# EAGLE design deneme (EAGLE 9.3.2)
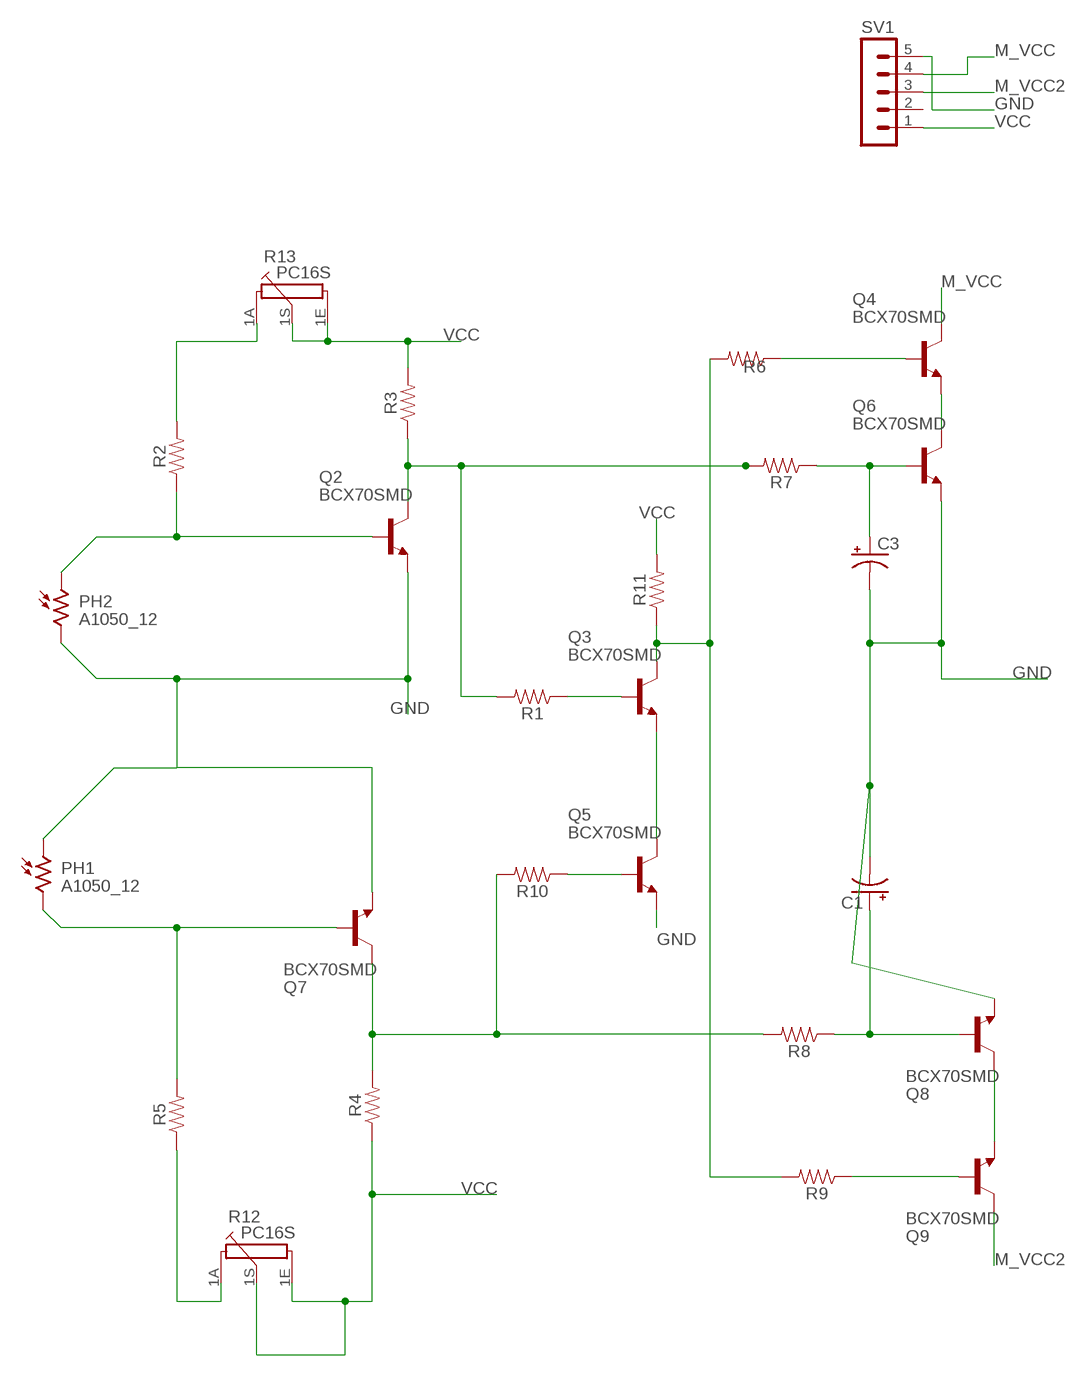
[diagram p0: schematic, sheet 1]

## Parts
C1  CPOL-USUD-6,3X7,7  [UD-6,3X7,7_NICHICON]
C3  CPOL-USUD-6,3X7,7  [UD-6,3X7,7_NICHICON]
PH1  A1050_12  [T0-46-A10XX]
PH2  A1050_12  [T0-46-A10XX]
Q2  BCX70SMD  [SOT23]
Q3  BCX70SMD  [SOT23]
Q4  BCX70SMD  [SOT23]
Q5  BCX70SMD  [SOT23]
Q6  BCX70SMD  [SOT23]
Q7  BCX70SMD  [SOT23]
Q8  BCX70SMD  [SOT23]
Q9  BCX70SMD  [SOT23]
R1  RESISTOR0805  [0805]
R2  RESISTOR0805  [0805]
R3  RESISTOR0805  [0805]
R4  RESISTOR0805  [0805]
R5  RESISTOR0805  [0805]
R6  RESISTOR0805  [0805]
R7  RESISTOR0805  [0805]
R8  RESISTOR0805  [0805]
R9  RESISTOR0805  [0805]
R10  RESISTOR0805  [0805]
R11  RESISTOR0805  [0805]
R12  PC16S  [PC16S]
R13  PC16S  [PC16S]
SV1  MA05-1  [MA05-1]

## Nets
GND: C1.- C3.- PH1.1 PH2.2 Q2.2(E) Q5.2(E) Q6.2(E) Q7.2(E) Q8.2(E) SV1.5
M_VCC: Q4.3(C) SV1.4
M_VCC2: Q9.3(C) SV1.3
N$1: R2.2 R13.1A
N$3: C3.+ Q6.1(B) R7.1
N$4: PH2.1 Q2.1(B) R2.1
N$5: Q4.1(B) R6.1
N$6: PH1.2 Q7.1(B) R5.2
N$7: R5.1 R12.1A
N$9: Q7.3(C) R4.2 R8.2 R10.2
N$10: Q5.1(B) R10.1
N$11: Q3.2(E) Q5.3(C)
N$12: Q3.1(B) R1.1
N$13: Q3.3(C) R6.2 R9.2 R11.1
N$14: Q2.3(C) R1.2 R3.1 R7.2
N$15: Q4.2(E) Q6.3(C)
N$19: C1.+ Q8.1(B) R8.1
N$20: Q8.3(C) Q9.2(E)
N$21: Q9.1(B) R9.1
VCC: R3.2 R4.1 R11.2 R12.1E R12.1S R13.1E R13.1S SV1.1
Unconnected: SV1.2

## Library data of the parts
C1 C3 = rcl:CPOL-US: POLARIZED CAPACITOR, American symbol; SPICEPREFIX: C
PH1 PH2 = photo-elements:A10: Sensor Robust Light Sensing Applications Outdoor Light Sensing Application Source: http://optoelectronics.perkinelmer.com/content/Datasheets/DTS_PhotocellsA1050.pdf
Q2-Q9 = transistor-npn:BCX70*: NPN Transistor
R1-R11 = SparkFun-Resistors:RESISTOR: Generic Resistor Package
R12 R13 = piher:PC16S: POTENTIOMETER single carbon potentiometer, 16 mm, S3ROH; OC_FARNELL: 4452940; OC_NEWARK: unknown
SV1 = con-lstb:MA05-1: PIN HEADER; OC_FARNELL: unknown; OC_NEWARK: unknown

## Board
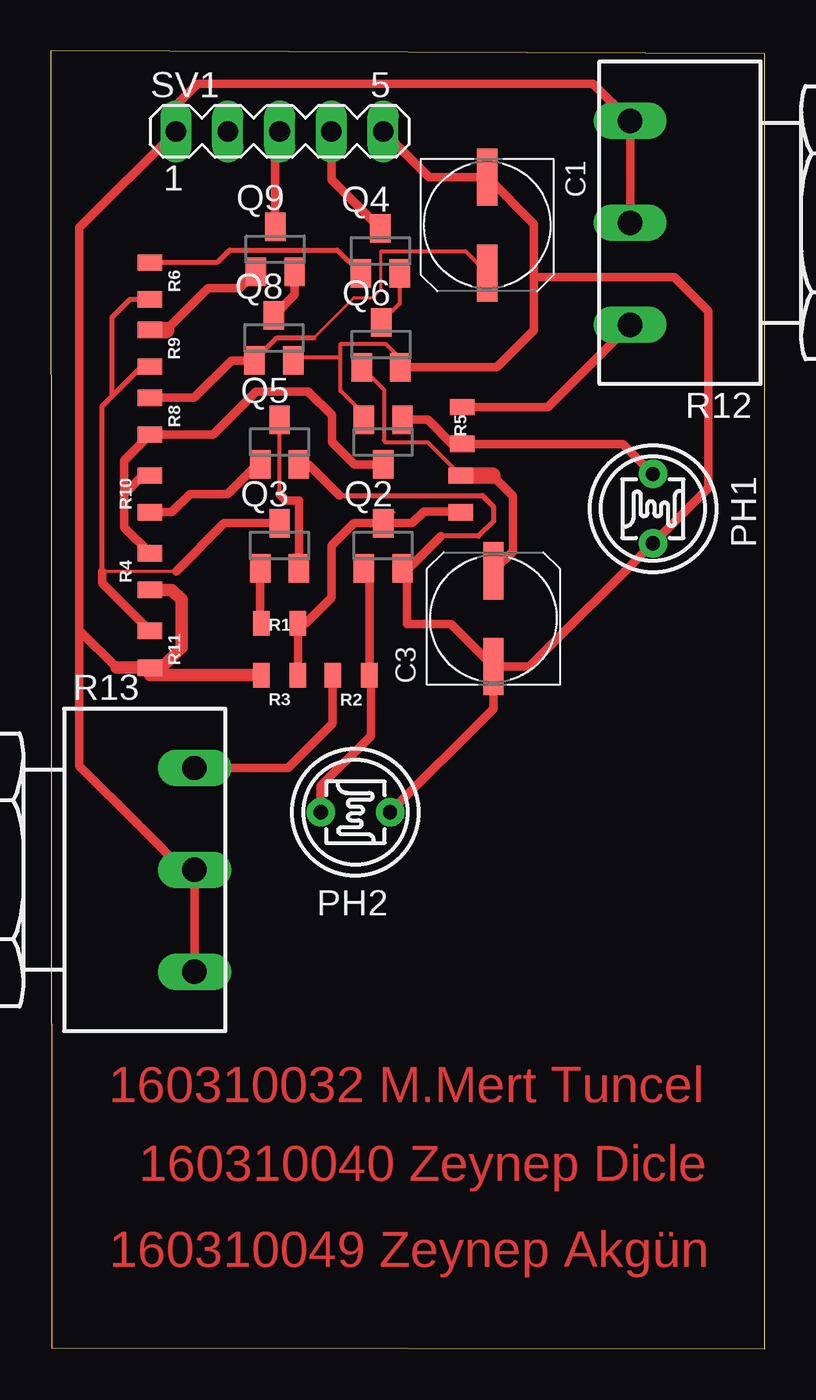
[diagram p1: board, top side]

Size 35.01 x 63.63 mm. Coordinates in mm from the lower left corner, seen from the top.
Outline: 0.03,0.02 35.01,0 35.01,63.49 0,63.63 0.03,0.02
Copper layers (1*16): Top 0.035mm / dielectric 1.5mm / Bottom 0.035mm
Design rules "default": minimum track width 6mil, minimum drill 0.35mm, track to track 6mil, track to pad 6mil, pad to pad 6mil, via to via 6mil, smd to smd 6mil, copper to edge 40mil, drill to drill 6mil, minimum pad ring 10mil, minimum via ring 8mil, stop-mask expansion 4mil, vias tented up to drill 0mil, thermal gap 10mil

### Footprints (pad centres in the part's own frame; a part is rotated, then mirrored left to right if it is on the bottom)
UD-6,3X7,7_NICHICON = smd 2.8 x 1: + 2.35,0; - -2.35,0
T0-46-A10XX = drill 0.7 pad 1.4: 1 -1.7,0; 2 1.7,0
SOT23 = smd 1 x 1.4: 1 -0.95,-1.1; 2 0.95,-1.1; 3 0,1.1
0805 = smd 0.8 x 1.2: 1 -0.9,0; 2 0.9,0
PC16S = drill 1.2 long: 1A -5,6.5; 1E 5,6.5; 1S 0,6.5
MA05-1 = drill 1.016 long: 1 -5.08,0; 2 -2.54,0; 3 0,0; 4 2.54,0; 5 5.08,0

### Placement (x,y rotation side)
C1  21.4,55.09 270 top
C3  21.7,35.79 90 top
PH1  29.53,41.19 90 top
PH2  14.94,26.3 0 top
Q2  16.29,39.37 0 top
Q3  11.21,39.37 0 top
Q4  16.15,53.82 0 top
Q5  11.21,44.45 0 top
Q6  16.19,49.23 0 top
Q7  16.29,44.45 180 top
Q8  10.93,49.56 0 top
Q9  11,53.9 0 top
R1  11.21,35.56 0 top
R2  14.72,33.01 180 top
R3  11.21,33.02 180 top
R4  4.86,38.1 90 top
R5  20.17,45.26 270 top
R6  4.86,52.35 270 top
R7  20.1,41.91 270 top
R8  4.86,45.72 270 top
R9  4.85,49.05 270 top
R10  4.86,41.91 90 top
R11  4.86,34.29 270 top
R12  34.91,55.21 90 top
R13  0.55,23.47 270 top
SV1  11.21,59.69 0 top

### Tracks (layer width: path | path; a pad name or v marks a point on that pad's centre or on a via)
GND
  Top 0.203: Q7.2 15.34,45.82 14.2,46.97 14.2,48.6 | 14.2,48.6 14.2,49.24 16.44,49.24 17.14,48.54 Q6.2 | 14.2,48.6 12.03,48.6
  Top 0.254: 14.15,41.83 21.16,41.83 21.7,41.29 21.7,40.56 20.98,39.84 19.13,39.84
  Top 0.406: 12.03,48.6 Q8.2 | Q5.2 12.63,43.35 14.15,41.83 | 19.13,39.84 17.56,38.27 Q2.2 17.46,38.05 17.46,35.52 19.62,35.52 C3.- | SV1.5 18.54,57.44 C1.- 23.7,55.14 23.7,52.54 | 23.7,52.54 23.7,49.95 21.87,48.12 Q6.2 | 23.7,52.54 30.57,52.54 32.25,50.86 32.25,42.2 PH1.1 23.48,33.44 C3.- | PH2.2 21.7,31.37 C3.-
M_VCC
  Top 0.406: Q4.3 13.75,57.32 SV1.4
M_VCC2
  Top 0.406: Q9.3 11,59.47 SV1.3
N$1
  Top 0.406: R2.2 13.82,30.66 11.63,28.47 R13.1A
N$3
  Top 0.152: 20.29,42.99 R7.1 20.47,42.81 | 16.33,44.53 16.41,44.45
  Top 0.203: Q6.1 16.33,47.04 16.33,44.53 | R7.1 18.46,44.45 16.41,44.45
  Top 0.406: 21.66,42.81 22.65,41.81 22.65,39.09 C3.+
  Top 0.813: R7.1 21.66,42.81
N$4
  Top 0.152: 15.57,38.49 Q2.1 15.62,37.99 | 15.7,32.93 R2.1
  Top 0.406: 15.7,32.93 15.7,30.05 13.24,27.59 PH2.1 | R2.1 15.62,37.99
N$5
  Top 0.254: R6.1 8.14,53.25 8.76,53.87 14.05,53.87 Q4.1
N$6
  Top 0.406: Q7.1 18.49,45.55 19.67,44.36 R5.2 28.05,44.36 PH1.2
N$7
  Top 0.406: R12.1A 24.37,46.16 R5.1
N$9
  Top 0.152: 5.23,44.82 R8.2 | R10.2 4.49,42.81 | 4.86,39.37 R4.2 | 14.9,43.35 15.02,43.35
  Top 0.406: R4.2 3.59,40.27 3.59,41.91 | 3.59,41.91 3.59,43.55 R8.2 7.95,44.82 10.06,46.94 12.62,46.94 13.8,45.76 13.8,44.45 14.9,43.35 | 4.49,42.81 3.59,41.91 | Q7.3 15.02,43.35
N$10
  Top 0.152: Q5.1 10.11,43.35
  Top 0.406: R10.1 5.93,41.01 6.83,41.91 8.67,41.91 10.11,43.35
N$11
  Top 0.152: 12.16,38.62 Q3.2
  Top 0.203: 11.21,41.91 Q5.3
  Top 0.406: Q3.2 12.16,41.59 11.53,41.59 11.21,41.91
N$12
  Top 0.152: 10.26,35.61 R1.1
  Top 0.406: Q3.1 10.26,35.61
N$13
  Top 0.152: 4.49,51.45 R6.2 | 6.13,38.1 2.51,38.1 | 4.45,48.15 R9.2
  Top 0.254: 2.51,38.1 2.51,46.21 3.01,46.71 | 3.01,46.71 3.01,50.59 3.87,51.45 R6.2 | 3.01,46.71 4.45,48.15
  Top 0.406: 2.51,38.1 2.51,37.54 R11.1 | Q3.3 8.5,40.47 6.13,38.1
N$14
  Top 0.152: R1.2 12.48,35.56 | Q2.3 16.83,41.01
  Top 0.406: R3.1 R1.2 | 12.48,35.56 13.75,36.83 13.75,39.37 14.85,40.47 Q2.3 17.71,40.47 18.29,41.05 20.07,41.05 R7.2
N$15
  Top 0.203: Q4.2 17.1,51.24 Q6.3
N$19
  Top 0.152: Q8.1 9.99,47.96 | 16.19,53.8 16.19,51.94 15.79,51.54 14.87,51.54 12.9,49.57
  Top 0.203: 16.19,53.8 20.34,53.8 C1.+
  Top 0.254: Q8.1 11.1,49.57 12.9,49.57
  Top 0.406: Q8.1 8.86,48.45 7.02,46.62 R8.1
N$20
  Top 0.406: Q9.2 11.95,51.67 Q8.3
N$21
  Top 0.406: 5.65,49.95 7.72,52.01 9.26,52.01 Q9.1
  Top 0.813: R9.1 5.65,49.95
VCC
  Top 0.152: R11.2 4.33,33.39 | R11.2 4.49,33.39 | 5.42,33.39 R11.2 | R11.2 4.86,33.02 | 4.32,25.64 4.39,25.57 6.49,23.47 | R13.1E 7.05,23.2 7.05,23.37
  Top 0.406: 1.4,35.22 1.4,54.95 SV1.1 6.13,60.96 7.2,62.03 26.59,62.03 R12.1E R12.1S | 1.4,35.22 3.22,33.39 | 4.32,25.64 1.4,28.56 1.4,35.22 | 6.49,23.47 6.95,23.47 | 6.95,23.47 R13.1S R13.1E | 7.05,23.37 6.95,23.47 | 4.39,25.57 6.76,23.2 7.05,23.2
  Top 0.61: R4.1 5.92,37.2 6.4,36.72 6.4,34.37 5.42,33.39 | R3.2 4.86,33.02 | 3.22,33.39 R11.2

### Text on the board
Top: 160310032 M.Mert Tuncel | 160310040 Zeynep Dicle | 160310049 Zeynep Akgün